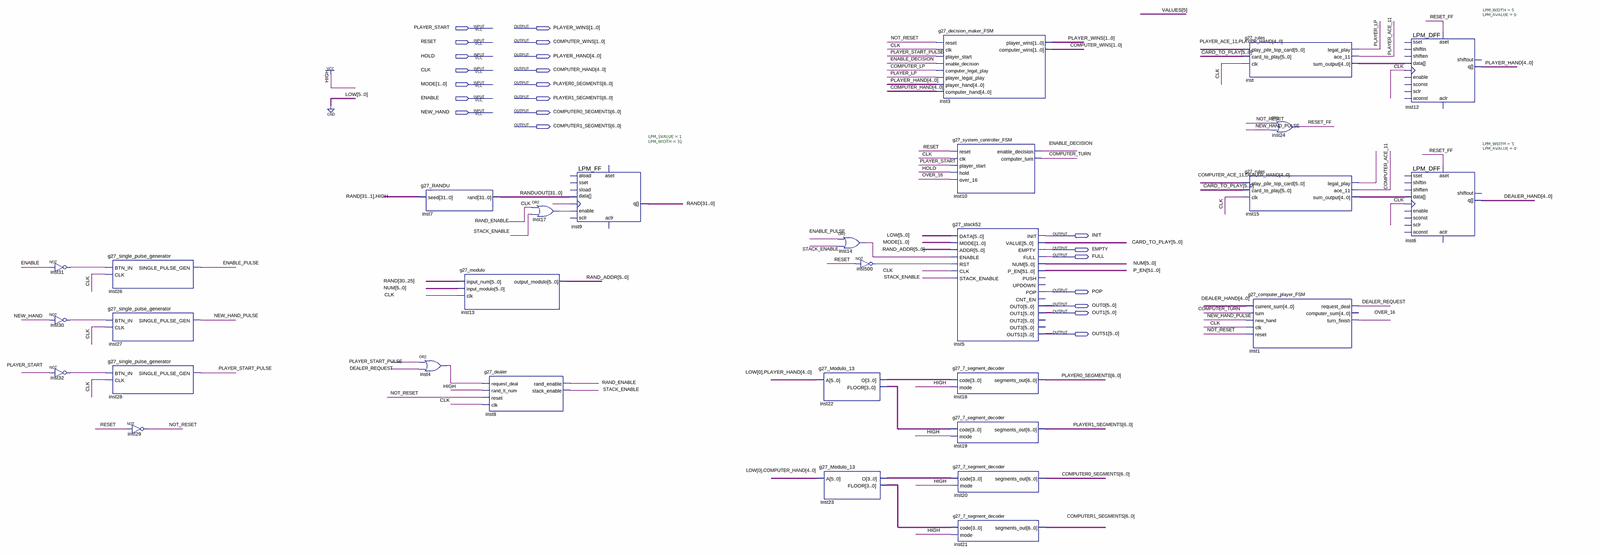
[diagram p0: schematic sheet, whole]
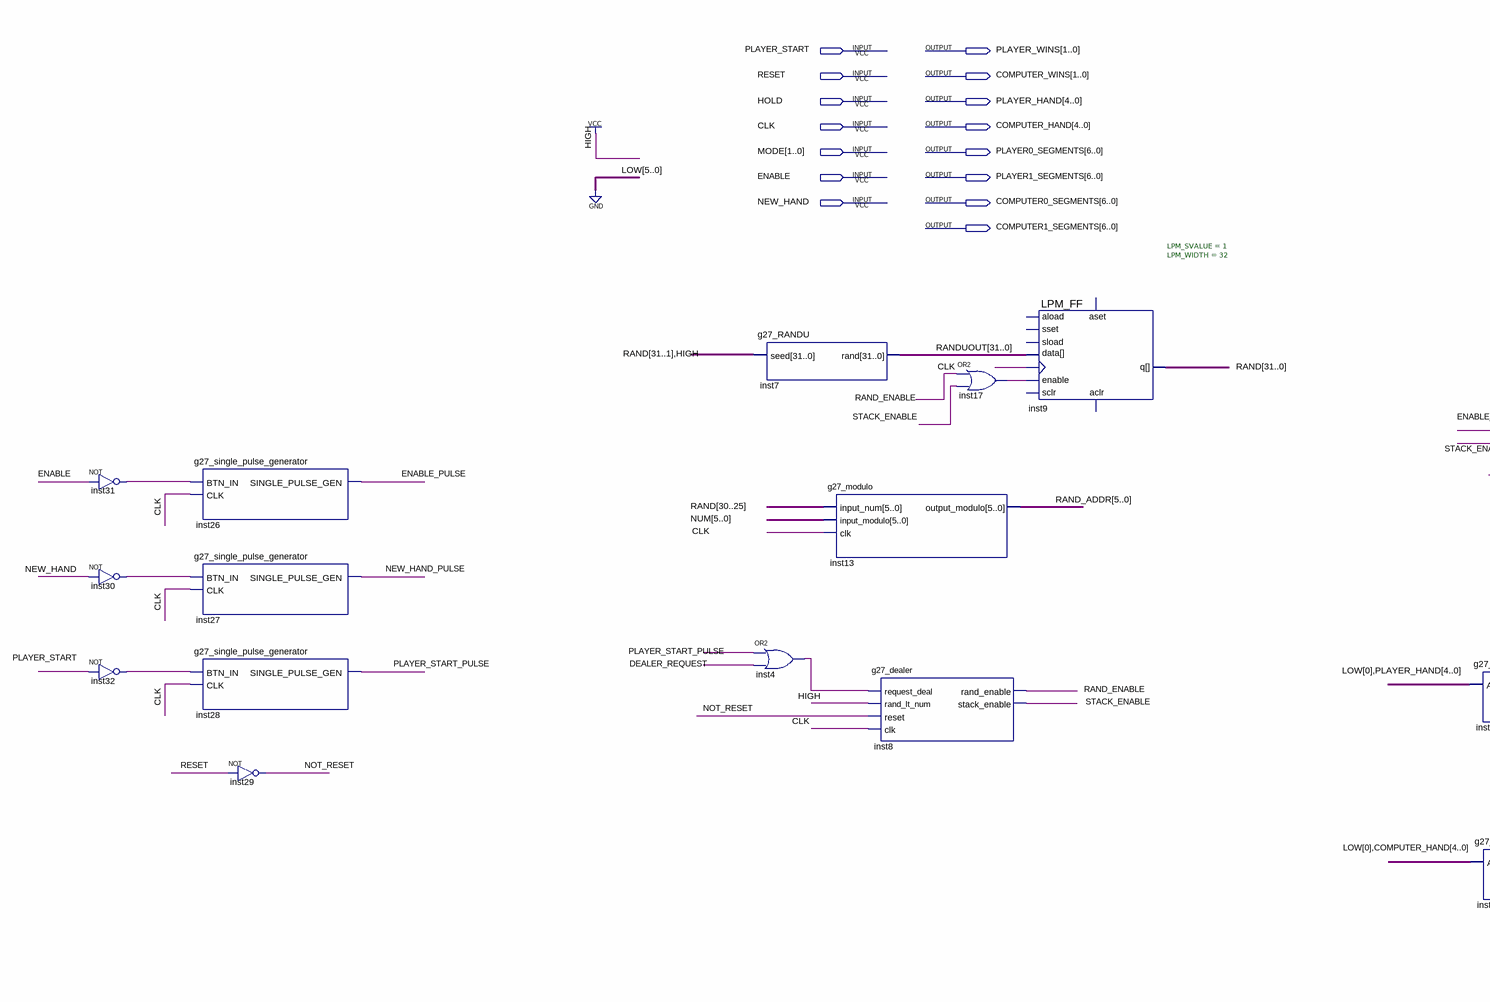
[diagram p1: schematic sheet, left part]
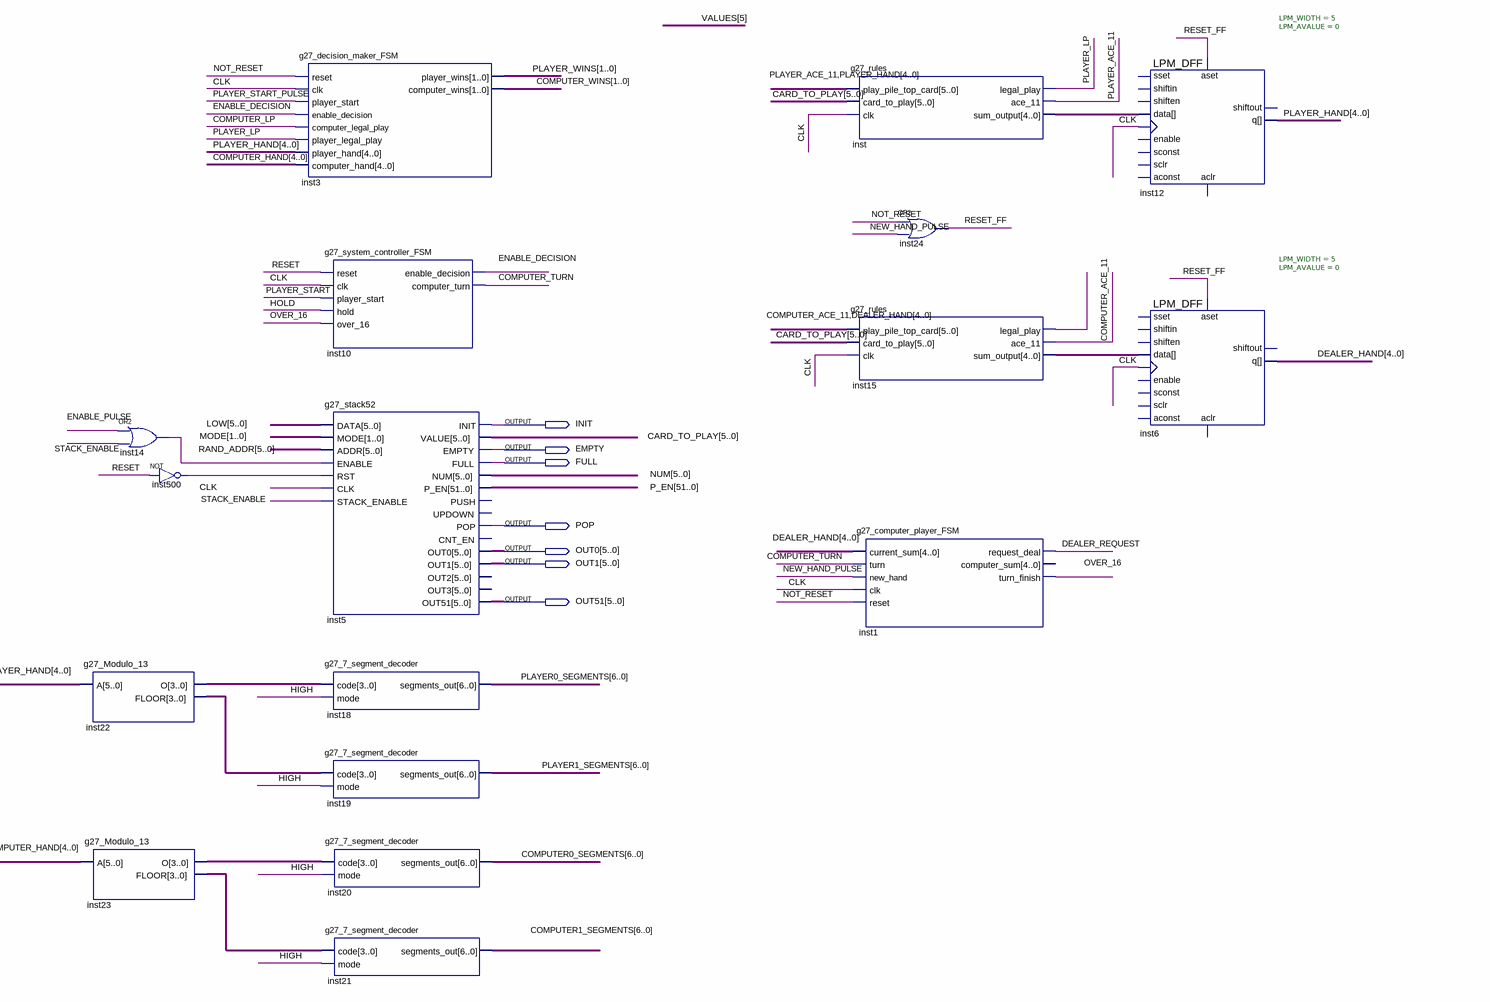
[diagram p2: schematic sheet, right part]
// Quartus schematic g27_21game_backup.bdf as structural Verilog: 30 symbols, 22 pins
module g27_21game_backup (
  input  PLAYER_START,
  input  RESET,
  input  HOLD,
  input  CLK,
  input  [1:0] MODE,
  input  ENABLE,
  input  NEW_HAND,
  output [1:0] PLAYER_WINS,
  output [1:0] COMPUTER_WINS,
  output [4:0] PLAYER_HAND,
  output [4:0] COMPUTER_HAND,
  output [6:0] PLAYER0_SEGMENTS,
  output [6:0] PLAYER1_SEGMENTS,
  output [6:0] COMPUTER0_SEGMENTS,
  output [6:0] COMPUTER1_SEGMENTS,
  output INIT,
  output EMPTY,
  output FULL,
  output POP,
  output [5:0] OUT0,
  output [5:0] OUT1,
  output [5:0] OUT51
);

  wire COMPUTER_ACE_11, COMPUTER_LP, COMPUTER_TURN, DEALER_REQUEST, ENABLE_DECISION, ENABLE_PULSE, inst4_out,
       inst14_out, inst15_legal_play, inst17_out, inst30_out, inst31_out, inst32_out, inst500_out,
       NEW_HAND_PULSE, NOT_RESET, OVER_16, PLAYER_ACE_11, PLAYER_LP, PLAYER_START_PULSE, RAND_ENABLE,
       RESET_FF, STACK_ENABLE;
  wire [3:0] inst22_floor, inst22_o, inst23_floor, inst23_o;
  wire [4:0] DEALER_HAND, inst15_sum_output, inst_sum_output;
  wire [5:0] CARD_TO_PLAY, NUM, RAND_ADDR;
  wire [31:0] RAND, RANDUOUT;
  wire [51:0] P_EN;

  not inst31 (inst31_out, ENABLE);
  not inst30 (inst30_out, NEW_HAND);
  not inst32 (inst32_out, PLAYER_START);
  g27_single_pulse_generator inst26 (.BTN_IN(inst31_out), .CLK(CLK), .SINGLE_PULSE_GEN(ENABLE_PULSE));
  g27_single_pulse_generator inst27 (.BTN_IN(inst30_out), .CLK(CLK), .SINGLE_PULSE_GEN(NEW_HAND_PULSE));
  g27_single_pulse_generator inst28 (.BTN_IN(inst32_out), .CLK(CLK), .SINGLE_PULSE_GEN(PLAYER_START_PULSE));
  not inst29 (NOT_RESET, RESET);
  g27_RANDU inst7 (.seed({RAND[31:1], 1'b1}), .\rand (RANDUOUT));
  or inst4 (inst4_out, PLAYER_START_PULSE, DEALER_REQUEST);
  g27_modulo inst13 (.input_num(RAND[30:25]), .input_modulo(NUM), .clk(CLK), .output_modulo(RAND_ADDR));
  g27_dealer inst8 (
    .request_deal(inst4_out), .rand_lt_num(1'b1), .reset(NOT_RESET), .clk(CLK), .rand_enable(RAND_ENABLE),
    .stack_enable(STACK_ENABLE));
  or inst17 (inst17_out, RAND_ENABLE, STACK_ENABLE);
  LPM_FF #(.LPM_SVALUE(1), .LPM_WIDTH(32)) inst9 (
    .enable(inst17_out), .clock(CLK), .data(RANDUOUT), .q(RAND));  // open: aload, sset, sload, aset, sclr, aclr
  g27_Modulo_13 inst22 (.A({1'b0, PLAYER_HAND}), .O(inst22_o), .FLOOR(inst22_floor));
  g27_Modulo_13 inst23 (.A({1'b0, COMPUTER_HAND}), .O(inst23_o), .FLOOR(inst23_floor));
  or inst14 (inst14_out, ENABLE_PULSE, STACK_ENABLE);
  not inst500 (inst500_out, RESET);
  g27_decision_maker_FSM inst3 (
    .reset(NOT_RESET), .clk(CLK), .player_start(PLAYER_START_PULSE), .enable_decision(ENABLE_DECISION),
    .computer_legal_play(COMPUTER_LP), .player_legal_play(PLAYER_LP), .player_hand(PLAYER_HAND),
    .computer_hand(COMPUTER_HAND), .player_wins(PLAYER_WINS), .computer_wins(COMPUTER_WINS));
  g27_system_controller_FSM inst10 (
    .reset(RESET), .clk(CLK), .player_start(PLAYER_START), .hold(HOLD), .over_16(OVER_16),
    .enable_decision(ENABLE_DECISION), .computer_turn(COMPUTER_TURN));
  g27_stack52 inst5 (
    .DATA({6{1'b0}}), .MODE(MODE), .ADDR(RAND_ADDR), .ENABLE(inst14_out), .RST(inst500_out), .CLK(CLK),
    .STACK_ENABLE(STACK_ENABLE), .INIT(INIT), .VALUE(CARD_TO_PLAY), .EMPTY(EMPTY), .FULL(FULL), .NUM(NUM),
    .P_EN(P_EN), .POP(POP), .OUT0(OUT0), .OUT1(OUT1), .OUT51(OUT51));  // open: PUSH, UPDOWN, CNT_EN, OUT2, OUT3
  g27_7_segment_decoder inst18 (.code(inst22_o), .mode(1'b1), .segments_out(PLAYER0_SEGMENTS));
  g27_7_segment_decoder inst19 (.code(inst22_floor), .mode(1'b1), .segments_out(PLAYER1_SEGMENTS));
  g27_7_segment_decoder inst20 (.code(inst23_o), .mode(1'b1), .segments_out(COMPUTER0_SEGMENTS));
  g27_7_segment_decoder inst21 (.code(inst23_floor), .mode(1'b1), .segments_out(COMPUTER1_SEGMENTS));
  g27_rules inst (
    .play_pile_top_card({PLAYER_ACE_11, PLAYER_HAND}), .card_to_play(CARD_TO_PLAY), .clk(CLK),
    .legal_play(PLAYER_LP), .ace_11(PLAYER_ACE_11), .sum_output(inst_sum_output));
  g27_rules inst15 (
    .play_pile_top_card({COMPUTER_ACE_11, DEALER_HAND}), .card_to_play(CARD_TO_PLAY), .clk(CLK),
    .legal_play(inst15_legal_play), .ace_11(COMPUTER_ACE_11), .sum_output(inst15_sum_output));
  g27_computer_player_FSM inst1 (
    .current_sum(DEALER_HAND), .turn(COMPUTER_TURN), .new_hand(NEW_HAND_PULSE), .clk(CLK), .reset(NOT_RESET),
    .request_deal(DEALER_REQUEST), .turn_finish(OVER_16));  // open: computer_sum
  or inst24 (RESET_FF, NOT_RESET, NEW_HAND_PULSE);
  LPM_DFF #(.LPM_WIDTH(5), .LPM_AVALUE(0)) inst12 (
    .clock(CLK), .data(inst_sum_output), .aset(RESET_FF), .q(PLAYER_HAND));  // open: shiftin, shiften, enable, aconst, sclr, sconst, sset, aclr, shiftout
  LPM_DFF #(.LPM_WIDTH(5), .LPM_AVALUE(0)) inst6 (
    .clock(CLK), .data(inst15_sum_output), .aset(RESET_FF), .q(DEALER_HAND));  // open: shiftin, shiften, enable, aconst, sclr, sconst, sset, aclr, shiftout
endmodule
